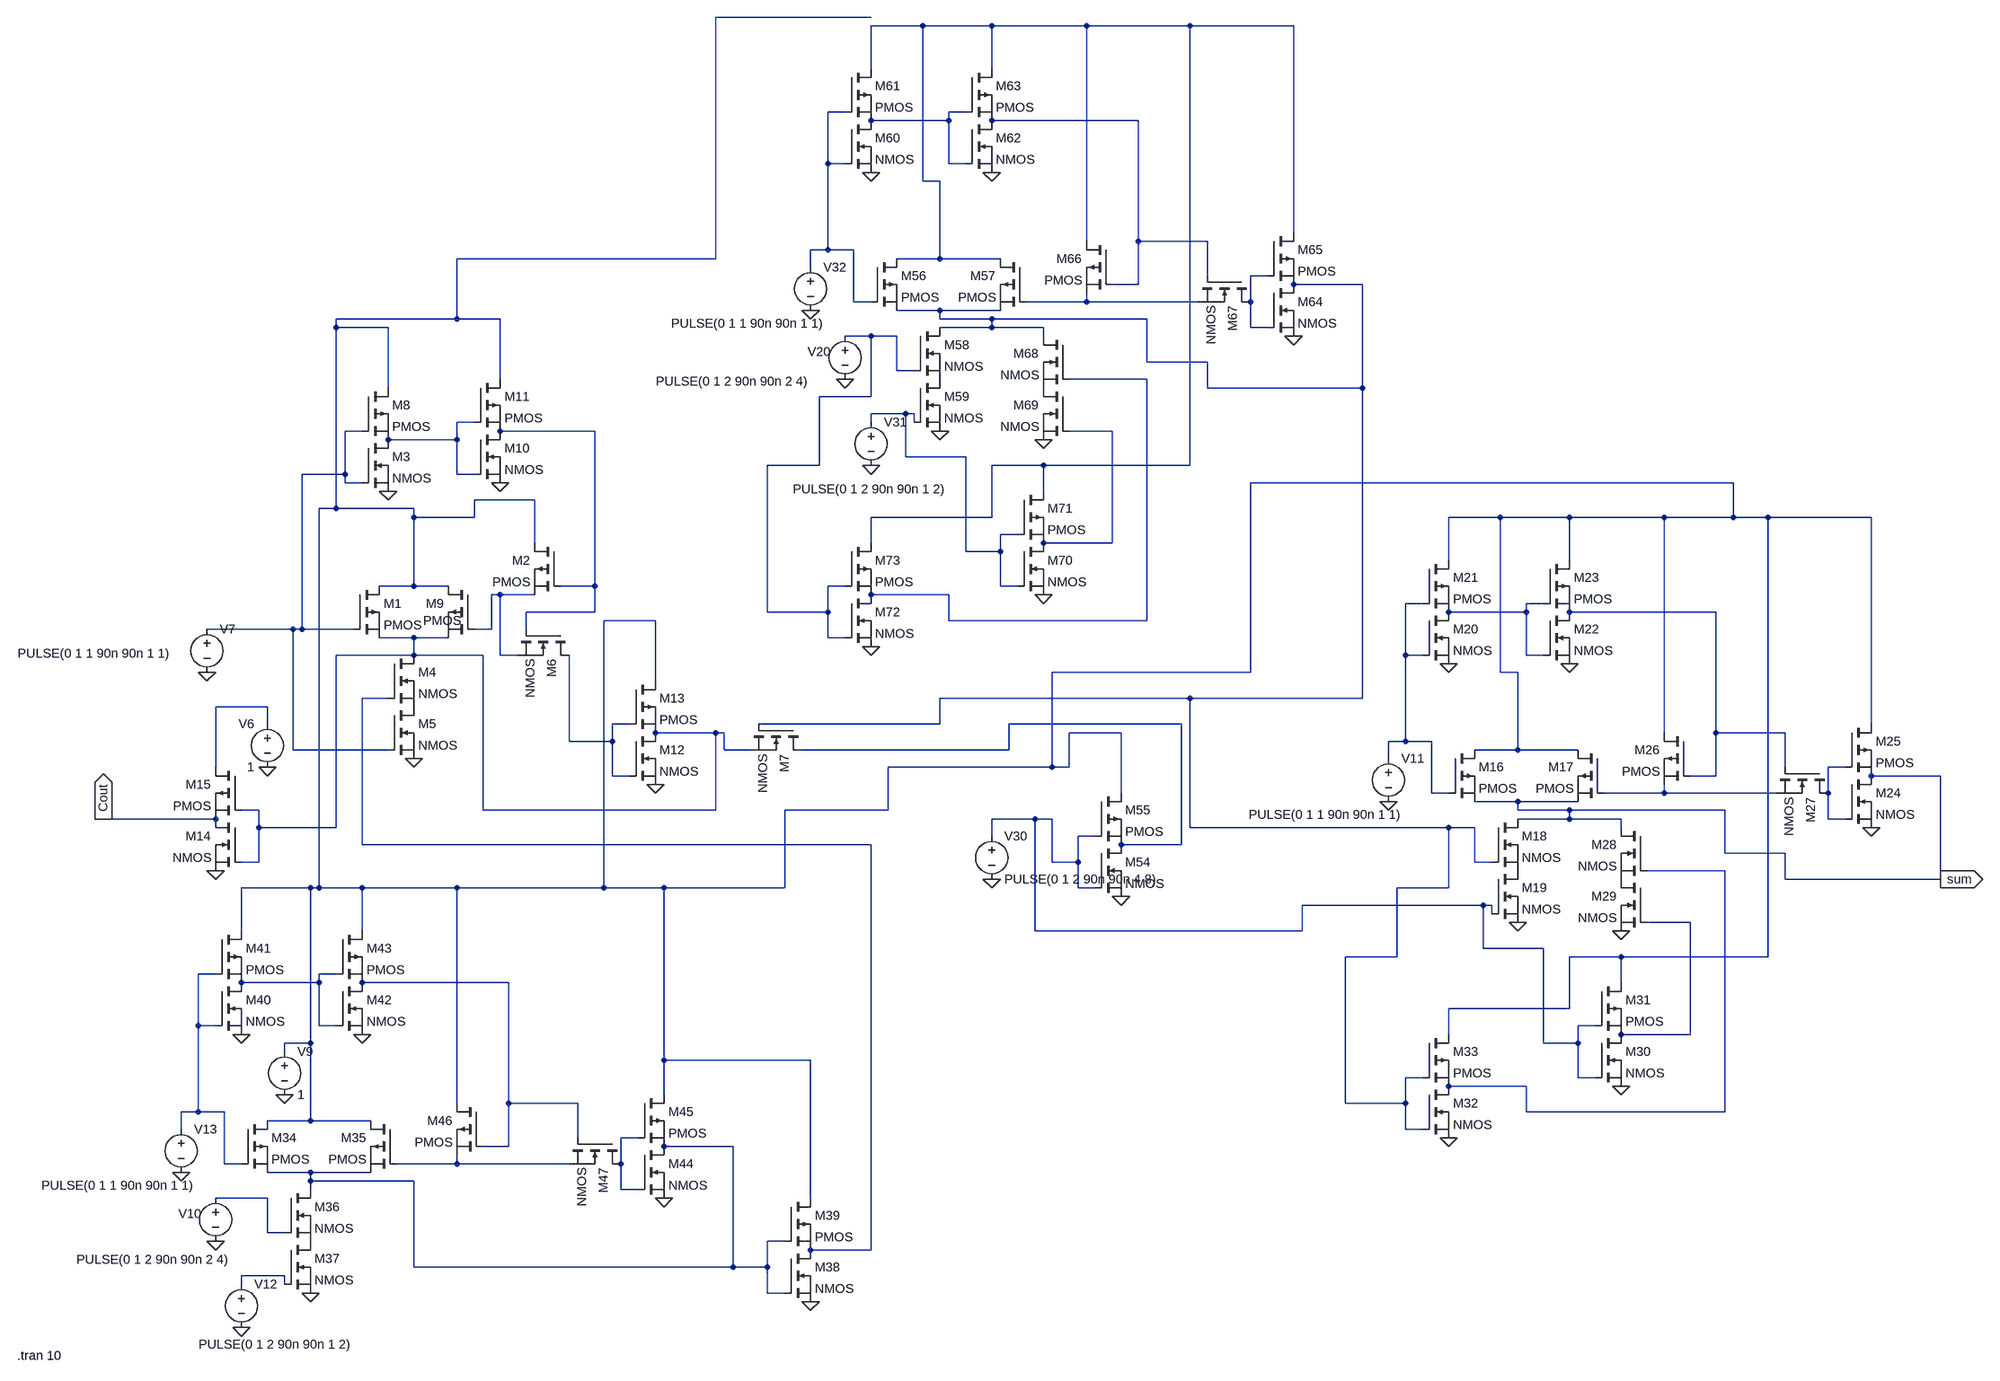
[diagram p0: schematic Draft2.asc]
Draft2.asc, the LTspice schematic file:
Version 4
SHEET 1 3660 1748
WIRE 1024 -976 736 -976
WIRE 1120 -960 1024 -960
WIRE 1248 -960 1120 -960
WIRE 1424 -960 1248 -960
WIRE 1616 -960 1424 -960
WIRE 1808 -960 1616 -960
WIRE 1024 -880 1024 -960
WIRE 1248 -880 1248 -960
WIRE 976 -800 944 -800
WIRE 1200 -800 1168 -800
WIRE 1168 -784 1168 -800
WIRE 1168 -784 1024 -784
WIRE 1520 -784 1248 -784
WIRE 944 -704 944 -800
WIRE 976 -704 944 -704
WIRE 1168 -704 1168 -784
WIRE 1200 -704 1168 -704
WIRE 1120 -672 1120 -960
WIRE 1152 -672 1120 -672
WIRE 1808 -576 1808 -960
WIRE 1424 -560 1424 -960
WIRE 1520 -560 1520 -784
WIRE 1648 -560 1520 -560
WIRE 944 -544 944 -704
WIRE 944 -544 912 -544
WIRE 992 -544 944 -544
WIRE 736 -528 736 -976
WIRE 736 -528 256 -528
WIRE 1152 -528 1152 -672
WIRE 1152 -528 1072 -528
WIRE 1264 -528 1152 -528
WIRE 912 -512 912 -544
WIRE 1648 -496 1648 -560
WIRE 1760 -496 1728 -496
WIRE 1520 -480 1520 -560
WIRE 1520 -480 1472 -480
WIRE 1936 -480 1808 -480
WIRE 992 -448 992 -544
WIRE 1024 -448 992 -448
WIRE 1424 -448 1424 -464
WIRE 1424 -448 1312 -448
WIRE 1632 -448 1424 -448
WIRE 1728 -448 1728 -496
WIRE 1152 -432 1072 -432
WIRE 1264 -432 1152 -432
WIRE 256 -416 256 -528
WIRE 256 -416 32 -416
WIRE 336 -416 256 -416
WIRE 1152 -416 1152 -432
WIRE 1248 -416 1152 -416
WIRE 1536 -416 1248 -416
WIRE 32 -400 32 -416
WIRE 128 -400 32 -400
WIRE 1248 -400 1248 -416
WIRE 1248 -400 1152 -400
WIRE 1344 -400 1248 -400
WIRE 1728 -400 1728 -448
WIRE 1760 -400 1728 -400
WIRE 1024 -384 976 -384
WIRE 1072 -384 1024 -384
WIRE 1344 -384 1344 -400
WIRE 1536 -336 1536 -416
WIRE 1648 -336 1536 -336
WIRE 1072 -320 1072 -384
WIRE 1104 -320 1072 -320
WIRE 336 -304 336 -416
WIRE 1536 -304 1392 -304
WIRE 128 -288 128 -400
WIRE 1648 -288 1648 -336
WIRE 1936 -288 1936 -480
WIRE 1936 -288 1648 -288
WIRE 1024 -272 1024 -384
WIRE 1024 -272 928 -272
WIRE 1088 -240 1024 -240
WIRE 1104 -240 1088 -240
WIRE 288 -224 256 -224
WIRE 1024 -224 1024 -240
WIRE 1104 -224 1104 -240
WIRE 80 -208 48 -208
WIRE 512 -208 336 -208
WIRE 1472 -208 1392 -208
WIRE 256 -192 256 -224
WIRE 256 -192 128 -192
WIRE 1088 -160 1088 -240
WIRE 1200 -160 1088 -160
WIRE 928 -144 928 -272
WIRE 928 -144 832 -144
WIRE 1344 -144 1248 -144
WIRE 1616 -144 1616 -960
WIRE 1616 -144 1344 -144
WIRE 48 -128 48 -208
WIRE 48 -128 -32 -128
WIRE 256 -128 256 -192
WIRE 288 -128 256 -128
WIRE 48 -112 48 -128
WIRE 80 -112 48 -112
WIRE 2624 -112 1728 -112
WIRE 1344 -96 1344 -144
WIRE 400 -80 288 -80
WIRE 32 -64 32 -400
WIRE 32 -64 0 -64
WIRE 176 -64 32 -64
WIRE 176 -48 176 -64
WIRE 288 -48 288 -80
WIRE 288 -48 176 -48
WIRE 1248 -48 1248 -144
WIRE 1248 -48 1024 -48
WIRE 2192 -48 2096 -48
WIRE 2320 -48 2192 -48
WIRE 2496 -48 2320 -48
WIRE 2624 -48 2624 -112
WIRE 2624 -48 2496 -48
WIRE 2688 -48 2624 -48
WIRE 2880 -48 2688 -48
WIRE 1296 -16 1264 -16
WIRE 400 0 400 -80
WIRE 1024 0 1024 -48
WIRE 1472 0 1472 -208
WIRE 1472 0 1344 0
WIRE 1200 16 1200 -160
WIRE 1264 16 1264 -16
WIRE 1264 16 1200 16
WIRE 2096 32 2096 -48
WIRE 2320 32 2320 -48
WIRE 176 80 176 -48
WIRE 176 80 112 80
WIRE 240 80 176 80
WIRE 512 80 512 -208
WIRE 512 80 448 80
WIRE 976 80 944 80
WIRE 1264 80 1264 16
WIRE 1296 80 1264 80
WIRE 336 96 320 96
WIRE 400 96 336 96
WIRE 1168 96 1024 96
WIRE 2048 112 2016 112
WIRE 2272 112 2240 112
WIRE 512 128 512 80
WIRE 512 128 384 128
WIRE 832 128 832 -144
WIRE 944 128 944 80
WIRE 944 128 832 128
WIRE 2240 128 2240 112
WIRE 2240 128 2096 128
WIRE 2592 128 2320 128
WIRE 624 144 528 144
WIRE 1168 144 1168 96
WIRE 1536 144 1536 -304
WIRE 1536 144 1168 144
WIRE -48 160 -208 160
WIRE -32 160 -32 -128
WIRE -32 160 -48 160
WIRE 64 160 -32 160
WIRE 320 160 320 96
WIRE 320 160 288 160
WIRE 384 160 384 128
WIRE 176 176 112 176
WIRE 240 176 176 176
WIRE 944 176 944 128
WIRE 976 176 944 176
WIRE 176 208 176 176
WIRE 176 208 32 208
WIRE 304 208 176 208
WIRE 336 208 336 96
WIRE 368 208 336 208
WIRE 2016 208 2016 112
WIRE 2048 208 2016 208
WIRE 2240 208 2240 128
WIRE 2272 208 2240 208
WIRE 1728 240 1728 -112
WIRE 1728 240 1360 240
WIRE 2192 240 2192 -48
WIRE 2224 240 2192 240
WIRE 624 256 624 144
WIRE 128 288 80 288
WIRE 1616 288 1152 288
WIRE 1936 288 1936 -288
WIRE 1936 288 1616 288
WIRE -96 304 -192 304
WIRE -96 336 -96 304
WIRE 576 336 544 336
WIRE 1152 336 1152 288
WIRE 1152 336 816 336
WIRE 1600 336 1280 336
WIRE 2880 336 2880 -48
WIRE 736 352 624 352
WIRE 752 352 736 352
WIRE 1488 352 1392 352
WIRE 2496 352 2496 -48
WIRE 2592 352 2592 128
WIRE 2720 352 2592 352
WIRE 464 368 464 208
WIRE 544 368 544 336
WIRE 544 368 464 368
WIRE 2016 368 2016 208
WIRE 2016 368 1984 368
WIRE 2064 368 2016 368
WIRE -48 384 -48 160
WIRE 128 384 -48 384
WIRE 752 384 752 352
WIRE 800 384 752 384
WIRE 1280 384 1280 336
WIRE 1280 384 896 384
WIRE 2224 384 2224 240
WIRE 2224 384 2144 384
WIRE 2336 384 2224 384
WIRE 1984 400 1984 368
WIRE -192 416 -192 304
WIRE 1360 416 1360 240
WIRE 1360 416 1056 416
WIRE 1392 416 1392 352
WIRE 1392 416 1360 416
WIRE 2720 416 2720 352
WIRE 2832 416 2800 416
WIRE 544 432 544 368
WIRE 576 432 544 432
WIRE 2592 432 2592 352
WIRE 2592 432 2544 432
WIRE 3008 432 2880 432
WIRE 1488 464 1488 352
WIRE 2064 464 2064 368
WIRE 2096 464 2064 464
WIRE 2496 464 2496 448
WIRE 2496 464 2384 464
WIRE 2704 464 2496 464
WIRE 2800 464 2800 416
WIRE 2224 480 2144 480
WIRE 2336 480 2224 480
WIRE -112 496 -144 496
WIRE 304 496 304 208
WIRE 736 496 736 352
WIRE 736 496 304 496
WIRE 1056 496 1056 416
WIRE 1056 496 864 496
WIRE 2224 496 2224 480
WIRE 2320 496 2224 496
WIRE 2608 496 2320 496
WIRE -400 512 -416 512
WIRE -192 512 -400 512
WIRE 1328 512 1248 512
WIRE 1360 512 1328 512
WIRE 2320 512 2320 496
WIRE 2320 512 2224 512
WIRE 2416 512 2320 512
WIRE 2800 512 2800 464
WIRE 2832 512 2800 512
WIRE -112 528 -112 496
WIRE 32 528 32 208
WIRE 32 528 -112 528
WIRE 1616 528 1616 288
WIRE 2096 528 1616 528
WIRE 2144 528 2096 528
WIRE 2416 528 2416 512
WIRE 1248 544 1248 512
WIRE 1440 544 1408 544
WIRE 80 560 80 288
WIRE 1024 560 80 560
WIRE 1600 560 1600 336
WIRE 1600 560 1488 560
WIRE 2608 576 2608 496
WIRE 2720 576 2608 576
WIRE -112 592 -112 528
WIRE -112 592 -144 592
WIRE 1360 592 1360 512
WIRE 1408 592 1408 544
WIRE 1408 592 1360 592
WIRE 2144 592 2144 528
WIRE 2176 592 2144 592
WIRE 2608 608 2464 608
WIRE 2720 624 2720 576
WIRE 3008 624 3008 432
WIRE 3008 624 2720 624
WIRE -16 640 -144 640
WIRE 0 640 0 -64
WIRE 0 640 -16 640
WIRE 80 640 0 640
WIRE 256 640 80 640
WIRE 528 640 528 144
WIRE 528 640 256 640
WIRE 640 640 528 640
WIRE 864 640 864 496
WIRE 864 640 640 640
WIRE 1408 640 1408 592
WIRE 1440 640 1408 640
WIRE 2096 640 2096 528
WIRE 2096 640 2000 640
WIRE 2160 672 1824 672
WIRE 2176 672 2160 672
WIRE 2176 688 2176 672
WIRE 2544 704 2464 704
WIRE -144 720 -144 640
WIRE 80 720 80 640
WIRE 1328 720 1328 512
WIRE 1824 720 1824 672
WIRE 1824 720 1328 720
WIRE 2160 752 2160 672
WIRE 2272 752 2160 752
WIRE 2000 768 2000 640
WIRE 2000 768 1904 768
WIRE 2416 768 2320 768
WIRE 2688 768 2688 -48
WIRE 2688 768 2416 768
WIRE -192 800 -224 800
WIRE 32 800 0 800
WIRE 0 816 0 800
WIRE 0 816 -144 816
WIRE 352 816 80 816
WIRE 2416 816 2416 768
WIRE 2320 864 2320 768
WIRE 2320 864 2096 864
WIRE -224 896 -224 800
WIRE -192 896 -224 896
WIRE 0 896 0 816
WIRE 32 896 0 896
WIRE 2368 896 2336 896
WIRE 2096 912 2096 864
WIRE 2544 912 2544 704
WIRE 2544 912 2416 912
WIRE -16 928 -16 640
WIRE -16 928 -64 928
WIRE 2272 928 2272 752
WIRE 2336 928 2336 896
WIRE 2336 928 2272 928
WIRE -64 944 -64 928
WIRE 640 960 640 640
WIRE 912 960 640 960
WIRE 2048 992 2016 992
WIRE 2336 992 2336 928
WIRE 2368 992 2336 992
WIRE 2240 1008 2096 1008
WIRE 640 1024 640 960
WIRE 256 1040 256 640
WIRE 352 1040 352 816
WIRE 480 1040 352 1040
WIRE 1904 1040 1904 768
WIRE 2016 1040 2016 992
WIRE 2016 1040 1904 1040
WIRE -224 1056 -224 896
WIRE -224 1056 -256 1056
WIRE -176 1056 -224 1056
WIRE 2240 1056 2240 1008
WIRE 2608 1056 2608 608
WIRE 2608 1056 2240 1056
WIRE -16 1072 -16 928
WIRE -16 1072 -96 1072
WIRE 96 1072 -16 1072
WIRE -256 1088 -256 1056
WIRE 2016 1088 2016 1040
WIRE 2048 1088 2016 1088
WIRE 480 1104 480 1040
WIRE 592 1104 560 1104
WIRE 352 1120 352 1040
WIRE 352 1120 304 1120
WIRE 768 1120 640 1120
WIRE -176 1152 -176 1056
WIRE -144 1152 -176 1152
WIRE 256 1152 256 1136
WIRE 256 1152 144 1152
WIRE 464 1152 256 1152
WIRE 560 1152 560 1104
WIRE -16 1168 -96 1168
WIRE 96 1168 -16 1168
WIRE -16 1184 -16 1168
WIRE 176 1184 -16 1184
WIRE -16 1200 -16 1184
WIRE 560 1200 560 1152
WIRE 592 1200 560 1200
WIRE -96 1216 -192 1216
WIRE 912 1216 912 960
WIRE -96 1280 -96 1216
WIRE -64 1280 -96 1280
WIRE 864 1296 832 1296
WIRE 1024 1312 1024 560
WIRE 1024 1312 912 1312
WIRE 176 1344 176 1184
WIRE 768 1344 768 1120
WIRE 768 1344 176 1344
WIRE 832 1344 832 1296
WIRE 832 1344 768 1344
WIRE -64 1360 -144 1360
WIRE -144 1376 -144 1360
WIRE -64 1376 -64 1360
WIRE 832 1392 832 1344
WIRE 864 1392 832 1392
FLAG 176 400 0
FLAG 128 -96 0
FLAG 336 -112 0
FLAG 624 448 0
FLAG -96 416 0
FLAG -192 608 0
FLAG -208 240 0
FLAG 1488 656 0
FLAG 1248 624 0
FLAG 1152 -208 0
FLAG 976 -304 0
FLAG 1024 -144 0
FLAG 1024 -688 0
FLAG 1248 -688 0
FLAG 1808 -384 0
FLAG 912 -432 0
FLAG 1344 -192 0
FLAG 1344 96 0
FLAG 1024 192 0
FLAG 2224 704 0
FLAG 2096 224 0
FLAG 2320 224 0
FLAG 2880 528 0
FLAG 1984 480 0
FLAG 2416 720 0
FLAG 2416 1008 0
FLAG 2096 1104 0
FLAG 3008 624 sum
IOPIN 3008 624 Out
FLAG -400 512 Cout
IOPIN -400 512 Out
FLAG -16 1392 0
FLAG -64 1024 0
FLAG -192 1296 0
FLAG -144 1456 0
FLAG 912 1408 0
FLAG -144 912 0
FLAG 80 912 0
FLAG 640 1216 0
FLAG -256 1168 0
SYMBOL pmos 64 80 R0
SYMATTR InstName M1
SYMBOL nmos 128 208 R0
SYMATTR InstName M4
SYMBOL nmos 128 304 R0
SYMATTR InstName M5
SYMBOL nmos 464 160 R90
SYMATTR InstName M6
SYMBOL nmos 896 336 R90
SYMATTR InstName M7
SYMBOL pmos 288 80 M0
WINDOW 3 24 64 Left 2
SYMATTR InstName M9
SYMBOL pmos 448 0 M0
SYMATTR InstName M2
SYMBOL nmos 80 -192 R0
SYMATTR InstName M3
SYMBOL pmos 80 -288 R0
SYMATTR InstName M8
SYMBOL nmos 288 -208 R0
SYMATTR InstName M10
SYMBOL pmos 288 -304 R0
SYMATTR InstName M11
SYMBOL nmos 576 352 R0
SYMATTR InstName M12
SYMBOL pmos 576 256 R0
SYMATTR InstName M13
SYMBOL nmos -144 512 M0
SYMATTR InstName M14
SYMBOL pmos -144 416 M0
SYMATTR InstName M15
SYMBOL voltage -96 320 M0
WINDOW 123 0 0 Left 0
WINDOW 39 0 0 Left 0
SYMATTR InstName V6
SYMATTR Value 1
SYMBOL voltage -208 144 R0
WINDOW 3 -351 61 Left 2
WINDOW 123 0 0 Left 0
WINDOW 39 0 0 Left 0
SYMATTR InstName V7
SYMATTR Value PULSE(0 1 1 90n 90n 1 1)
SYMBOL nmos 1440 560 R0
SYMATTR InstName M54
SYMBOL pmos 1440 464 R0
SYMATTR InstName M55
SYMBOL voltage 1248 528 R0
WINDOW 123 0 0 Left 0
WINDOW 39 0 0 Left 0
SYMATTR InstName V30
SYMATTR Value PULSE(0 1 2 90n 90n 4 8)
SYMBOL pmos 1024 -528 R0
SYMATTR InstName M56
SYMBOL pmos 1312 -528 M0
SYMATTR InstName M57
SYMBOL nmos 1104 -400 R0
SYMATTR InstName M58
SYMBOL nmos 1104 -304 R0
SYMATTR InstName M59
SYMBOL voltage 976 -400 R0
WINDOW 0 -69 45 Left 2
WINDOW 3 -351 100 Left 2
WINDOW 123 0 0 Left 0
WINDOW 39 0 0 Left 0
SYMATTR InstName V20
SYMATTR Value PULSE(0 1 2 90n 90n 2 4)
SYMBOL voltage 1024 -240 R0
WINDOW 3 -145 140 Left 2
WINDOW 123 0 0 Left 0
WINDOW 39 0 0 Left 0
SYMATTR Value PULSE(0 1 2 90n 90n 1 2)
SYMATTR InstName V31
SYMBOL nmos 976 -784 R0
SYMATTR InstName M60
SYMBOL pmos 976 -880 R0
SYMATTR InstName M61
SYMBOL nmos 1200 -784 R0
SYMATTR InstName M62
SYMBOL pmos 1200 -880 R0
SYMATTR InstName M63
SYMBOL nmos 1760 -480 R0
SYMATTR InstName M64
SYMBOL pmos 1760 -576 R0
SYMATTR InstName M65
SYMBOL voltage 912 -528 R0
WINDOW 3 -259 120 Left 2
WINDOW 123 0 0 Left 0
WINDOW 39 0 0 Left 0
SYMATTR InstName V32
SYMATTR Value PULSE(0 1 1 90n 90n 1 1)
SYMBOL pmos 1472 -560 M0
SYMATTR InstName M66
SYMBOL nmos 1728 -496 R90
SYMATTR InstName M67
SYMBOL nmos 1392 -384 M0
SYMATTR InstName M68
SYMBOL nmos 1392 -288 M0
SYMATTR InstName M69
SYMBOL nmos 1296 0 R0
SYMATTR InstName M70
SYMBOL pmos 1296 -96 R0
SYMATTR InstName M71
SYMBOL nmos 976 96 R0
SYMATTR InstName M72
SYMBOL pmos 976 0 R0
SYMATTR InstName M73
SYMBOL pmos 2096 384 R0
SYMATTR InstName M16
SYMBOL pmos 2384 384 M0
SYMATTR InstName M17
SYMBOL nmos 2176 512 R0
SYMATTR InstName M18
SYMBOL nmos 2176 608 R0
SYMATTR InstName M19
SYMBOL nmos 2048 128 R0
SYMATTR InstName M20
SYMBOL pmos 2048 32 R0
SYMATTR InstName M21
SYMBOL nmos 2272 128 R0
SYMATTR InstName M22
SYMBOL pmos 2272 32 R0
SYMATTR InstName M23
SYMBOL nmos 2832 432 R0
SYMATTR InstName M24
SYMBOL pmos 2832 336 R0
SYMATTR InstName M25
SYMBOL voltage 1984 384 R0
WINDOW 3 -259 120 Left 2
WINDOW 123 0 0 Left 0
WINDOW 39 0 0 Left 0
SYMATTR InstName V11
SYMATTR Value PULSE(0 1 1 90n 90n 1 1)
SYMBOL pmos 2544 352 M0
SYMATTR InstName M26
SYMBOL nmos 2800 416 R90
SYMATTR InstName M27
SYMBOL nmos 2464 528 M0
SYMATTR InstName M28
SYMBOL nmos 2464 624 M0
SYMATTR InstName M29
SYMBOL nmos 2368 912 R0
SYMATTR InstName M30
SYMBOL pmos 2368 816 R0
SYMATTR InstName M31
SYMBOL nmos 2048 1008 R0
SYMATTR InstName M32
SYMBOL pmos 2048 912 R0
SYMATTR InstName M33
SYMBOL pmos -144 1072 R0
SYMATTR InstName M34
SYMBOL pmos 144 1072 M0
SYMATTR InstName M35
SYMBOL nmos -64 1200 R0
SYMATTR InstName M36
SYMBOL nmos -64 1296 R0
SYMATTR InstName M37
SYMBOL voltage -64 928 R0
WINDOW 123 0 0 Left 0
WINDOW 39 0 0 Left 0
SYMATTR InstName V9
SYMATTR Value 1
SYMBOL voltage -192 1200 R0
WINDOW 0 -69 45 Left 2
WINDOW 3 -258 130 Left 2
WINDOW 123 0 0 Left 0
WINDOW 39 0 0 Left 0
SYMATTR InstName V10
SYMATTR Value PULSE(0 1 2 90n 90n 2 4)
SYMBOL voltage -144 1360 R0
WINDOW 3 -79 127 Left 2
WINDOW 123 0 0 Left 0
WINDOW 39 0 0 Left 0
SYMATTR Value PULSE(0 1 2 90n 90n 1 2)
SYMATTR InstName V12
SYMBOL nmos 864 1312 R0
SYMATTR InstName M38
SYMBOL pmos 864 1216 R0
SYMATTR InstName M39
SYMBOL nmos -192 816 R0
SYMATTR InstName M40
SYMBOL pmos -192 720 R0
SYMATTR InstName M41
SYMBOL nmos 32 816 R0
SYMATTR InstName M42
SYMBOL pmos 32 720 R0
SYMATTR InstName M43
SYMBOL nmos 592 1120 R0
SYMATTR InstName M44
SYMBOL pmos 592 1024 R0
SYMATTR InstName M45
SYMBOL voltage -256 1072 R0
WINDOW 3 -259 120 Left 2
WINDOW 123 0 0 Left 0
WINDOW 39 0 0 Left 0
SYMATTR InstName V13
SYMATTR Value PULSE(0 1 1 90n 90n 1 1)
SYMBOL pmos 304 1040 M0
SYMATTR InstName M46
SYMBOL nmos 560 1104 R90
SYMATTR InstName M47
TEXT -560 1508 Left 2 !.tran 10

The netlist it stands for:
* Draft2.asc
M1 N001 N013 N020 N020 PMOS
M4 N020 N021 P001 P001 NMOS
M5 P001 N013 0 0 NMOS
M6 N023 N014 N016 N016 NMOS
M7 N024 N007 N020 N020 NMOS
M9 N001 N016 N020 N020 PMOS
M2 N001 N014 N016 N016 PMOS
M3 N012 N013 0 0 NMOS
M8 N001 N013 N012 N012 PMOS
M10 N014 N012 0 0 NMOS
M11 N001 N012 N014 N014 PMOS
M12 N020 N023 0 0 NMOS
M13 N001 N023 N020 N020 PMOS
M14 Cout N020 0 0 NMOS
M15 N022 N020 Cout Cout PMOS
V6 N022 0 1
V7 N013 0 PULSE(0 1 1 90n 90n 1 1)
M54 N024 N027 0 0 NMOS
M55 N001 N027 N024 N024 PMOS
V30 N027 0 PULSE(0 1 2 90n 90n 4 8)
M56 N002 N003 N007 N007 PMOS
M57 N002 N008 N007 N007 PMOS
M58 N007 N009 P002 P002 NMOS
M59 P002 N011 0 0 NMOS
V20 N009 0 PULSE(0 1 2 90n 90n 2 4)
V31 N011 0 PULSE(0 1 2 90n 90n 1 2)
M60 N004 N003 0 0 NMOS
M61 N002 N003 N004 N004 PMOS
M62 N005 N004 0 0 NMOS
M63 N002 N004 N005 N005 PMOS
M64 N007 N006 0 0 NMOS
M65 N002 N006 N007 N007 PMOS
V32 N003 0 PULSE(0 1 1 90n 90n 1 1)
M66 N002 N005 N008 N008 PMOS
M67 N006 N005 N008 N008 NMOS
M68 N007 N010 P003 P003 NMOS
M69 P003 N015 0 0 NMOS
M70 N015 N011 0 0 NMOS
M71 N002 N011 N015 N015 PMOS
M72 N010 N009 0 0 NMOS
M73 N002 N009 N010 N010 PMOS
M16 N001 N017 sum sum PMOS
M17 N001 N026 sum sum PMOS
M18 sum N007 P004 P004 NMOS
M19 P004 N027 0 0 NMOS
M20 N018 N017 0 0 NMOS
M21 N001 N017 N018 N018 PMOS
M22 N019 N018 0 0 NMOS
M23 N001 N018 N019 N019 PMOS
M24 sum N025 0 0 NMOS
M25 N001 N025 sum sum PMOS
V11 N017 0 PULSE(0 1 1 90n 90n 1 1)
M26 N001 N019 N026 N026 PMOS
M27 N025 N019 N026 N026 NMOS
M28 sum N028 P005 P005 NMOS
M29 P005 N029 0 0 NMOS
M30 N029 N027 0 0 NMOS
M31 N001 N027 N029 N029 PMOS
M32 N028 N007 0 0 NMOS
M33 N001 N007 N028 N028 PMOS
M34 N001 N030 N034 N034 PMOS
M35 N001 N035 N034 N034 PMOS
M36 N034 N036 P006 P006 NMOS
M37 P006 N037 0 0 NMOS
V9 N001 0 1
V10 N036 0 PULSE(0 1 2 90n 90n 2 4)
V12 N037 0 PULSE(0 1 2 90n 90n 1 2)
M38 N021 N034 0 0 NMOS
M39 N001 N034 N021 N021 PMOS
M40 N031 N030 0 0 NMOS
M41 N001 N030 N031 N031 PMOS
M42 N032 N031 0 0 NMOS
M43 N001 N031 N032 N032 PMOS
M44 N034 N033 0 0 NMOS
M45 N001 N033 N034 N034 PMOS
V13 N030 0 PULSE(0 1 1 90n 90n 1 1)
M46 N001 N032 N035 N035 PMOS
M47 N033 N032 N035 N035 NMOS
.model NMOS NMOS
.model PMOS PMOS
.lib standard.mos
.tran 10
.backanno
.end